# Altium schematic sheet PAGE2-BLE, POWER, LORA.SchDoc (part 1 of 3)
size A3; DocumentNumber: 2; SheetNumber: 2; SheetTotal: 2
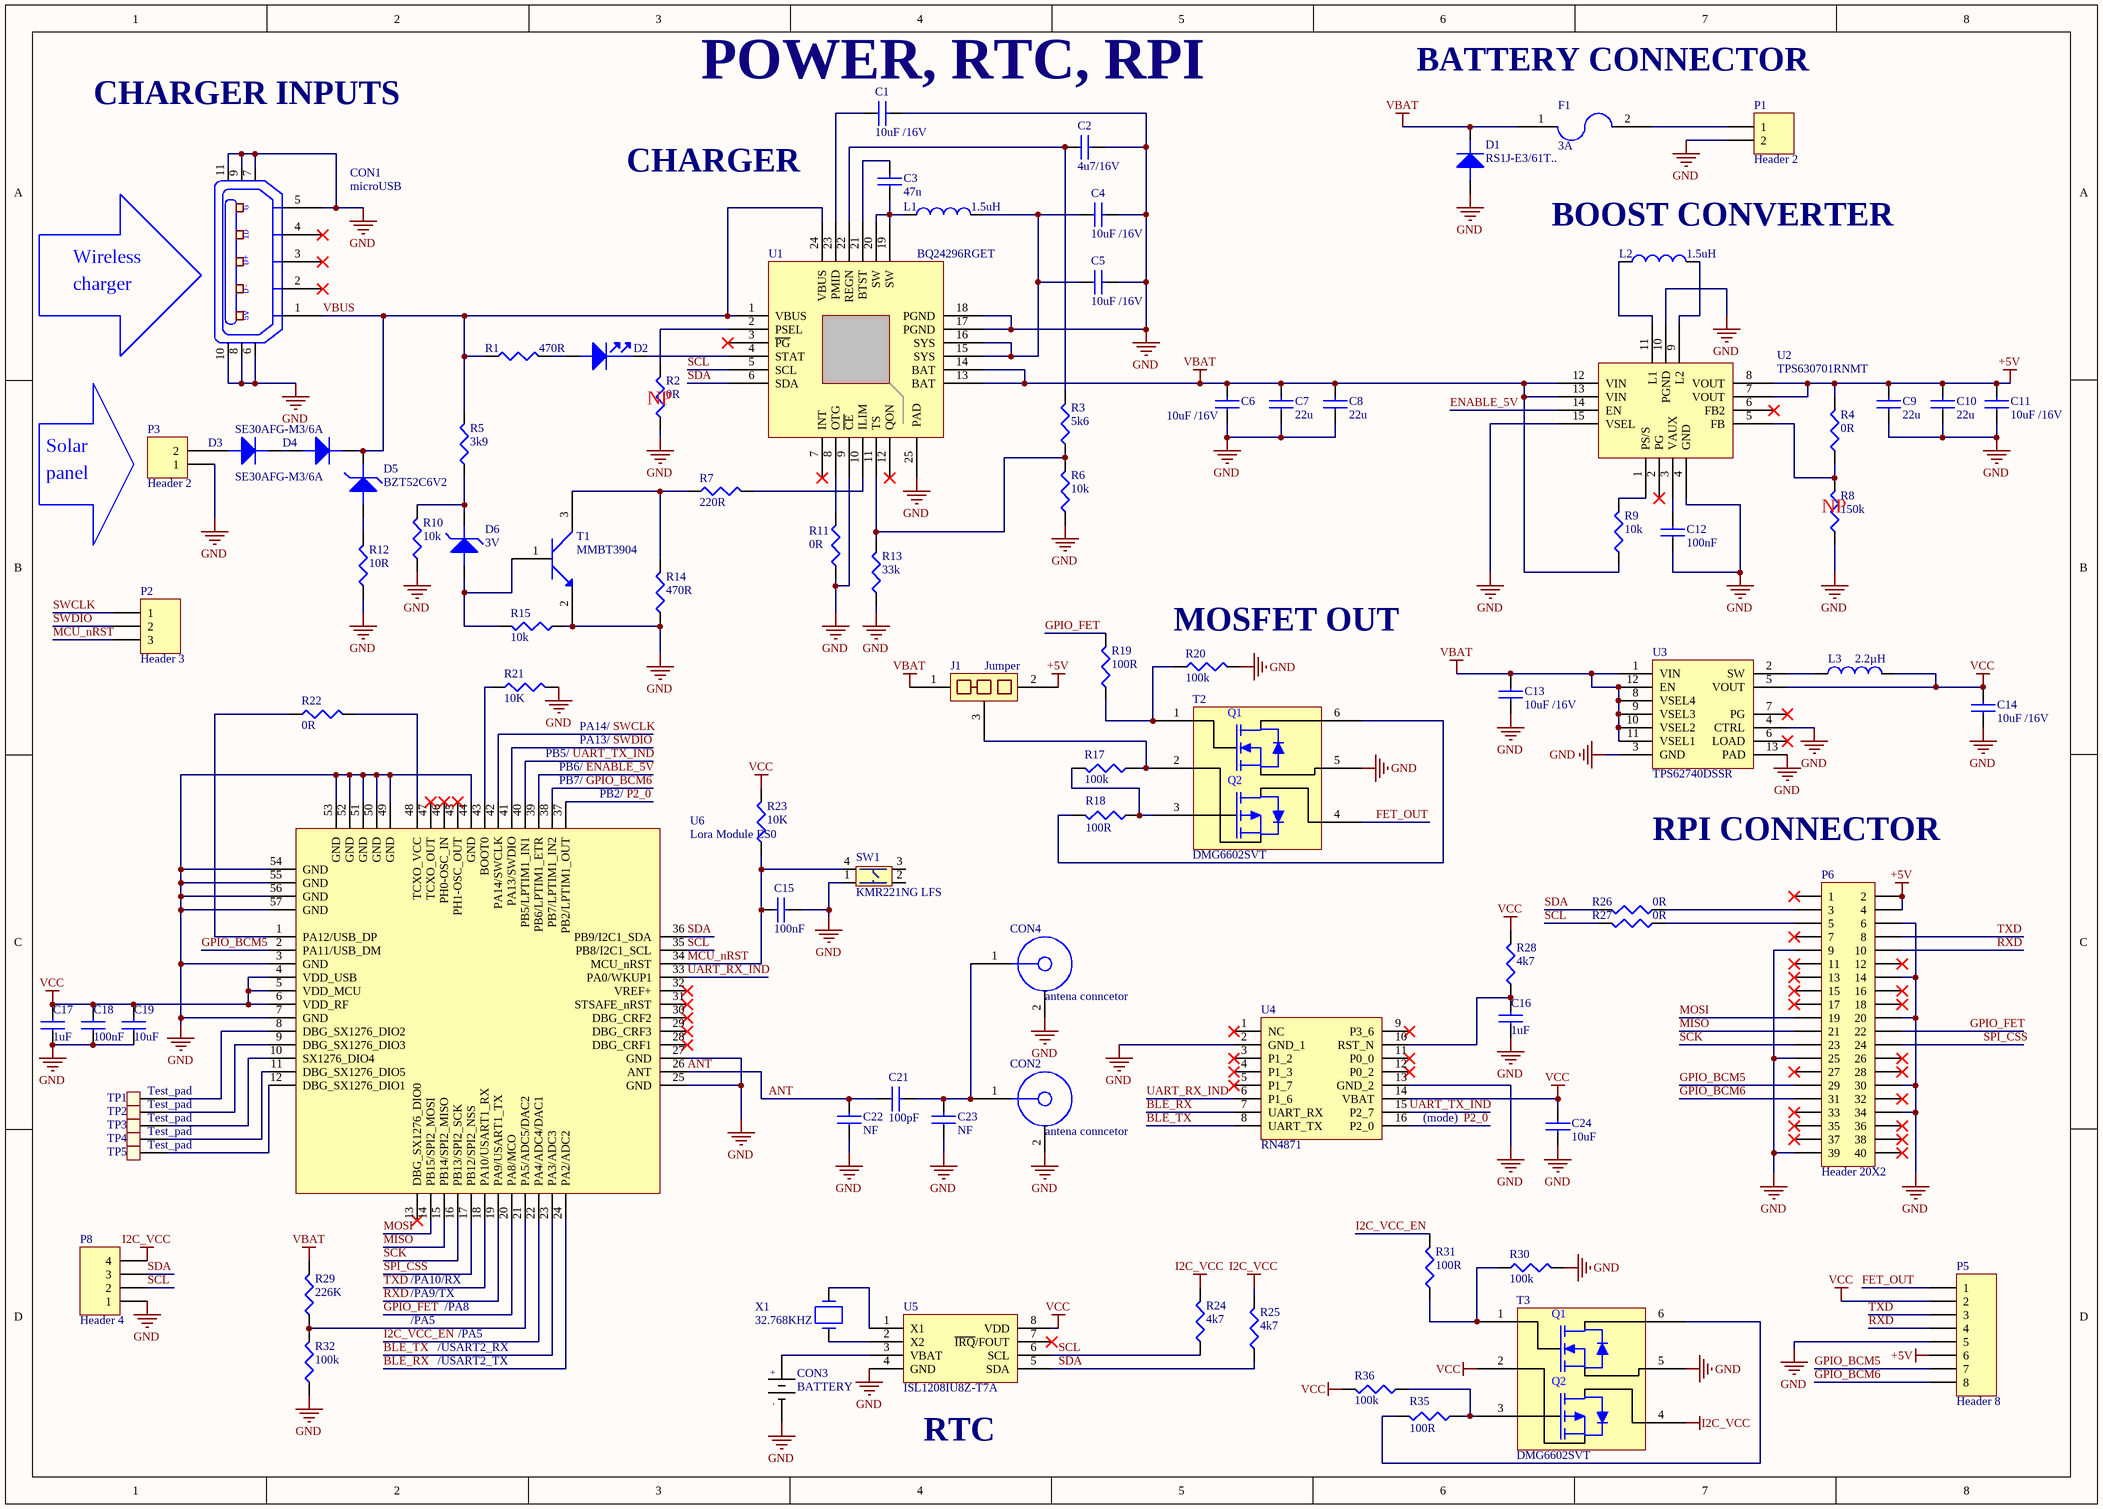
[diagram p0: PAGE2-BLE, POWER, LORA.SchDoc]

## Parts
C1  10uF /16V  [CAP0805]
C2  4u7/16V  [CAP0603]
C3  47n  [CAP0603]
C4  10uF /16V  [CAP0805]
C5  10uF /16V  [CAP0805]
C6  10uF /16V  [CAP0805]
C7  22u  [CAP0805]
C8  22u  [CAP0805]
C9  22u  [CAP0805]
C10  22u  [CAP0805]
C11  10uF /16V  [CAP0805]
C12  100nF  [CAP0603]
C13  10uF /16V  [CAP0805]
C14  10uF /16V  [CAP0805]
C15  100nF  [CAP0603]
C16  1uF  [CAP0603]
C17  1uF  [CAP0603]
C18  100nF  [CAP0603]
C19  10uF  [CAP0603]
C21  100pF  [CAP0402]
C22  NF  [CAP0402]
C23  NF  [CAP0402]
C24  10uF  [CAP0603]
CON1  microUSB  [microUSB-CHINA]  (no BOM)
CON2  antena conncetor  [ufl connector smd]
CON3  BATTERY  [CR-2032/VCN]
CON4  antena conncetor  [ufl connector smd]
D1  RS1J-E3/61T..  [SMC/DO-214AC]
D2  LED RED  [LED0603]  (value not drawn)
D3  SE30AFG-M3/6A  [SODFL127P600-8N]
D4  SE30AFG-M3/6A  [SODFL127P600-8N]
D5  BZT52C6V2  [SOD123]
D6  3V  [SOD-323 2L]
F1  3A  [Chip2PinSM127P600-8N]
J1  Jumper  [JUMPER_NC]
L1  1.5uH  [FDSD0402]
L2  1.5uH  [FDSD0402]
L3  2.2µH  [INDC2214X15N]
P1  Header 2  [HDR1X2]  (no BOM)
P2  Header 3  [HDR1X3]
P3  Header 2  [HDR1X2]  (no BOM)
P5  Header 8  [HDR1X8]  (no BOM)
P6  Header 20X2  [HDR2X20]  (no BOM)
P8  Header 4  [HDR1X4]
R1  470R  [RES0603]
R2  0R  [RES0603]
R3  5k6  [RES0603]
R4  0R  [RES0603]
R5  3k9  [RES0603]
R6  10k  [RES0603]
R7  220R  [RES0603]
R8  150k  [RES0603]
R9  10k  [RES0603]
R10  10k  [RES0603]
R11  0R  [RES0603]
R12  10R  [RES0603]
R13  33k  [RES0603]
R14  470R  [RES0603]
R15  10k  [RES0603]
R17  100k  [RES0603]
R18  100R  [RES0603]
R19  100R  [RES0603]
R20  100k  [RES0603]
R21  10K  [RES0603]
R22  0R  [RES0603]
R23  10K  [RES0603]
R24  4k7  [RES0603]
R25  4k7  [RES0603]
R26  0R  [RES0603]
R27  0R  [RES0603]
R28  4k7  [RES0603]
R29  226K  [RES0603]
R30  100k  [RES0603]
R31  100R  [RES0603]
R32  100k  [RES0603]
R35  100R  [RES0603]
R36  100k  [RES0603]
SW1  KMR221NG LFS  [Tactile button]
T1  MMBT3904  [SOT23127P600-8N]
T2  DMG6602SVT  [TSOT26]
T3  DMG6602SVT  [TSOT26]
TP1  Test_pad  [Test_pad]
TP2  Test_pad  [Test_pad]
TP3  Test_pad  [Test_pad]
TP4  Test_pad  [Test_pad]
TP5  Test_pad  [Test_pad]
U1  BQ24296RGET  [QFN4x4]
U2  TPS630701RNMT  [VQFN TPS]
U3  TPS62740DSSR  [SON50P200X265_HS-13N]
U4  RN4871  [RN4871]
U5  ISL1208IU8Z-T7A  [TSOP65P500X110-8N]
U6  Lora Module ES0  [Lora Module ES0]
X1  32.768KHZ  [LFXTAL009678]

## Nets
+5V: C9.2 C10.2 C11.2 J1.2 P5.6 P6.2 P6.4 R4.2 U2.7(VOUT) U2.8(VOUT)
GND: C1.2 C2.2 C4.2 C5.2 C6.1 C7.1 C8.1 C9.1 C10.1 C11.1 C12.1 C13.1 C14.1 C15.2 C16.1 C17.1 C18.1 C19.1 C22.1 C23.1 C24.1 CON1.5(P5) CON1.6 CON1.7 CON1.8 CON1.9 CON1.10 CON1.11 CON2.2 CON3.NEG CON4.2 D1.2(ANODE) P1.2 P3.1 P5.5 P6.6 P6.9 P6.14 P6.20 P6.25 P6.30 P6.34 P6.39 P8.1 R2.1 R6.1 R8.1 R10.1 R11.1 R12.1 R13.1 R14.1 R15.1 R20.2 R21.2 R30.2 R32.1 SW1.1 T1.2 T2.5(S1) T3.5(S1) U1.9(~{CE}) U1.17(PGND) U1.18(PGND) U1.25(PAD) U2.4(GND) U2.10(PGND) U2.15(VSEL) U3.3(GND) U3.4(CTRL) U3.13(PAD) U4.2(GND_1) U4.13(GND_2) U5.4(GND) U6.3(GND) U6.7(GND) U6.25(GND) U6.27(GND) U6.44(GND) U6.49(GND) U6.50(GND) U6.51(GND) U6.52(GND) U6.53(GND) U6.54(GND) U6.55(GND) U6.56(GND) U6.57(GND)
I2C_VCC: P8.4 R24.2 R25.2 T3.4(D2)
VBAT: C6.2 C7.2 C8.2 C13.2 D1.1(cathode) F1.1 J1.1 R9.1 R29.2 U1.13(BAT) U1.14(BAT) U2.12(VIN) U2.13(VIN) U3.1(VIN) U3.8(VSEL4) U3.9(VSEL3) U3.10(VSEL2) U3.11(VSEL1) U3.12(EN)
VCC: C14.2 C17.2 C18.2 C19.2 C24.2 L3.2 P5.2 R23.2 R28.2 R36.2 T3.2(S2) U3.5(VOUT) U4.14(VBAT) U5.8(VDD) U6.4(VDD_USB) U6.5(VDD_MCU) U6.6(VDD_RF)
ANT: C21.1 C22.2 U6.26(ANT)
BLE_RX: U4.7(UART_RX) U6.24(PA2/ADC2)
BLE_TX: U4.8(UART_TX) U6.23(PA3/ADC3)
ENABLE_5V: U2.14(EN) U6.39(PB6/LPTIM1_ETR)
FET_OUT: P5.1 T2.4(D2)
GPIO_BCM5: P5.7 P6.29 U6.2(PA11/USB_DM)
GPIO_BCM6: P5.8 P6.31 U6.38(PB7/LPTIM1_IN2)
GPIO_FET: P6.22 R19.2 U6.20(PA8/MCO)
I2C_VCC_EN: R31.2 U6.22(PA4/ADC4/DAC1)
MCU_nRST: C15.1 P2.3 R23.1 SW1.4 U6.34(MCU_nRST)
MISO: P6.21 U6.15(PB14/SPI2_MISO)
MOSI: P6.19 U6.14(PB15/SPI2_MOSI)
P2_0: U4.16(P2_0) U6.37(PB2/LPTIM1_OUT)
RXD: P5.4 P6.10 U6.19(PA9/USART1_TX)
SCK: P6.23 U6.16(PB13/SPI2_SCK)
SCL: P8.2 R24.1 R27.2 U1.5(SCL) U5.6(SCL) U6.35(PB8/I2C1_SCL)
SDA: P8.3 R25.1 R26.2 U1.6(SDA) U5.5(SDA) U6.36(PB9/I2C1_SDA)
SPI_CSS: P6.24 U6.17(PB12/SPI2_NSS)
SWCLK: P2.1 U6.42(PA14/SWCLK)
SWDIO: P2.2 U6.41(PA13/SWDIO)
TXD: P5.3 P6.8 U6.18(PA10/USART1_RX)
UART_RX_IND: U4.6(P1_6) U6.33(PA0/WKUP1)
UART_TX_IND: U4.15(P2_7) U6.40(PB5/LPTIM1_IN1)
VBUS: CON1.1(P1) D4.1(cathode) D5.1(cathode) R1.1 R5.2 U1.1(VBUS) U1.24(VBUS)
NetC1_1: C1.1 U1.23(PMID)
NetC2_1: C2.1 R3.2 U1.22(REGN)
NetC3_1: C3.1 L1.1 U1.19(SW) U1.20(SW)
NetC3_2: C3.2 U1.21(BTST)
NetC4_1: C4.1 C5.1 L1.2 U1.15(SYS) U1.16(SYS)
NetC12_2: C12.2 U2.3(VAUX)
NetC16_2: C16.2 R28.1 U4.10(RST_N)
NetC21_2: C21.2 C23.2 CON2.1 CON4.1
NetCON3_POS: CON3.POS U5.3(VBAT)
NetD2_1: D2.1(cathode) U1.4(STAT)
NetD2_2: D2.2(ANODE) R1.2
NetD3_1: D3.1(cathode) D4.2(ANODE)
NetD3_2: D3.2(ANODE) P3.2
NetD5_2: D5.2(ANODE) R12.2
NetD6_1: D6.1(cathode) R5.1 R10.2
NetD6_2: D6.2(ANODE) R15.2 T1.1
NetF1_2: F1.2 P1.1
NetJ1_3: J1.3 R17.1 T2.2(S2)
NetL2_1: L2.1 U2.11(L1)
NetL2_2: L2.2 U2.9(L2)
NetL3_1: L3.1 U3.2(SW)
NetP6_3: P6.3 R26.1
NetP6_5: P6.5 R27.1
NetR2_2: R2.2 U1.2(PSEL)
NetR3_1: R3.1 R6.2 R13.2 U1.11(TS)
NetR4_1: R4.1 R8.2 U2.5(FB)
NetR7_1: R7.1 R14.2 T1.3
NetR7_2: R7.2 U1.10(ILIM)
NetR9_2: R9.2 U2.1(PS/S)
NetR11_2: R11.2 U1.8(OTG)
NetR17_2: R17.2 R18.1 T2.3(G2)
NetR18_2: R18.2 T2.6(D1)
NetR19_1: R19.1 R20.1 T2.1(G1)
NetR21_1: R21.1 U6.43(BOOT0)
NetR22_1: R22.1 U6.1(PA12/USB_DP)
NetR22_2: R22.2 U6.48(TCXO_VCC)
NetR29_1: R29.1 R32.2 U6.21(PA5/ADC5/DAC2)
NetR30_1: R30.1 R31.1 T3.1(G1)
NetR35_1: R35.1 R36.1 T3.3(G2)
NetR35_2: R35.2 T3.6(D1)
NetTP1_1: TP1.1 U6.8(DBG_SX1276_DIO2)
NetTP2_1: TP2.1 U6.9(DBG_SX1276_DIO3)
NetTP3_1: TP3.1 U6.10(SX1276_DIO4)
NetTP4_1: TP4.1 U6.11(DBG_SX1276_DIO5)
NetTP5_1: TP5.1 U6.12(DBG_SX1276_DIO1)
NetU5_1: U5.1(X1) X1.2
NetU5_2: U5.2(X2) X1.1

Not connected (* = marked no-connect by the designer): CON1 2(P2)* 3(P3)* 4(P4)*; P6 1* 7* 11* 12* 13* 15* 16* 17* 18* 26* 27* 28* 32* 33* 35* 36* 37* 38* 40*; SW1 2 3; U1 3(~{PG})* 7(INT)* 12(QON)*; U2 2(PG)* 6(FB2)*; U3 6(LOAD)* 7(PG)*; U4 1(NC)* 3(P1_2)* 4(P1_3)* 5(P1_7)* 9(P3_6)* 11(P0_0)* 12(P0_2)*; U5 7(~{IRQ}/FOUT)*; U6 13(DBG_SX1276_DIO0)* 28(DBG_CRF1)* 29(DBG_CRF3)* 30(DBG_CRF2)* 31(STSAFE_nRST)* 32(VREF+)* 45(PH1-OSC_OUT)* 46(PH0-OSC_IN)* 47(TCXO_OUT)*

## Notes on the sheet
- CHARGER INPUTS
- (near C1) POWER, RTC, RPI
- BATTERY CONNECTOR
- CHARGER
- (near L2) BOOST CONVERTER
- Wireless
- charger
- Solar
- (near R2) NP
- panel
- (near R8) NP
- (near R20) MOSFET OUT
- PB5/
- PB6/
- (near U6) PB7/
- PA13/
- (near R21) PA14/
- (near U6) PB2/
- RPI CONNECTOR
- (near U4) (mode)
- /PA9/TX
- /PA10/RX
- /PA5
- /PA8
- /USART2_RX
- /USART2_TX
- (near U5) RTC
- (in symbol CR-2032/VCN) +; -
- (in symbol DMG6602SVT) Q1; Q2
- (in symbol Micro USB CHINA 1) G; ID; D+; D-; 5V